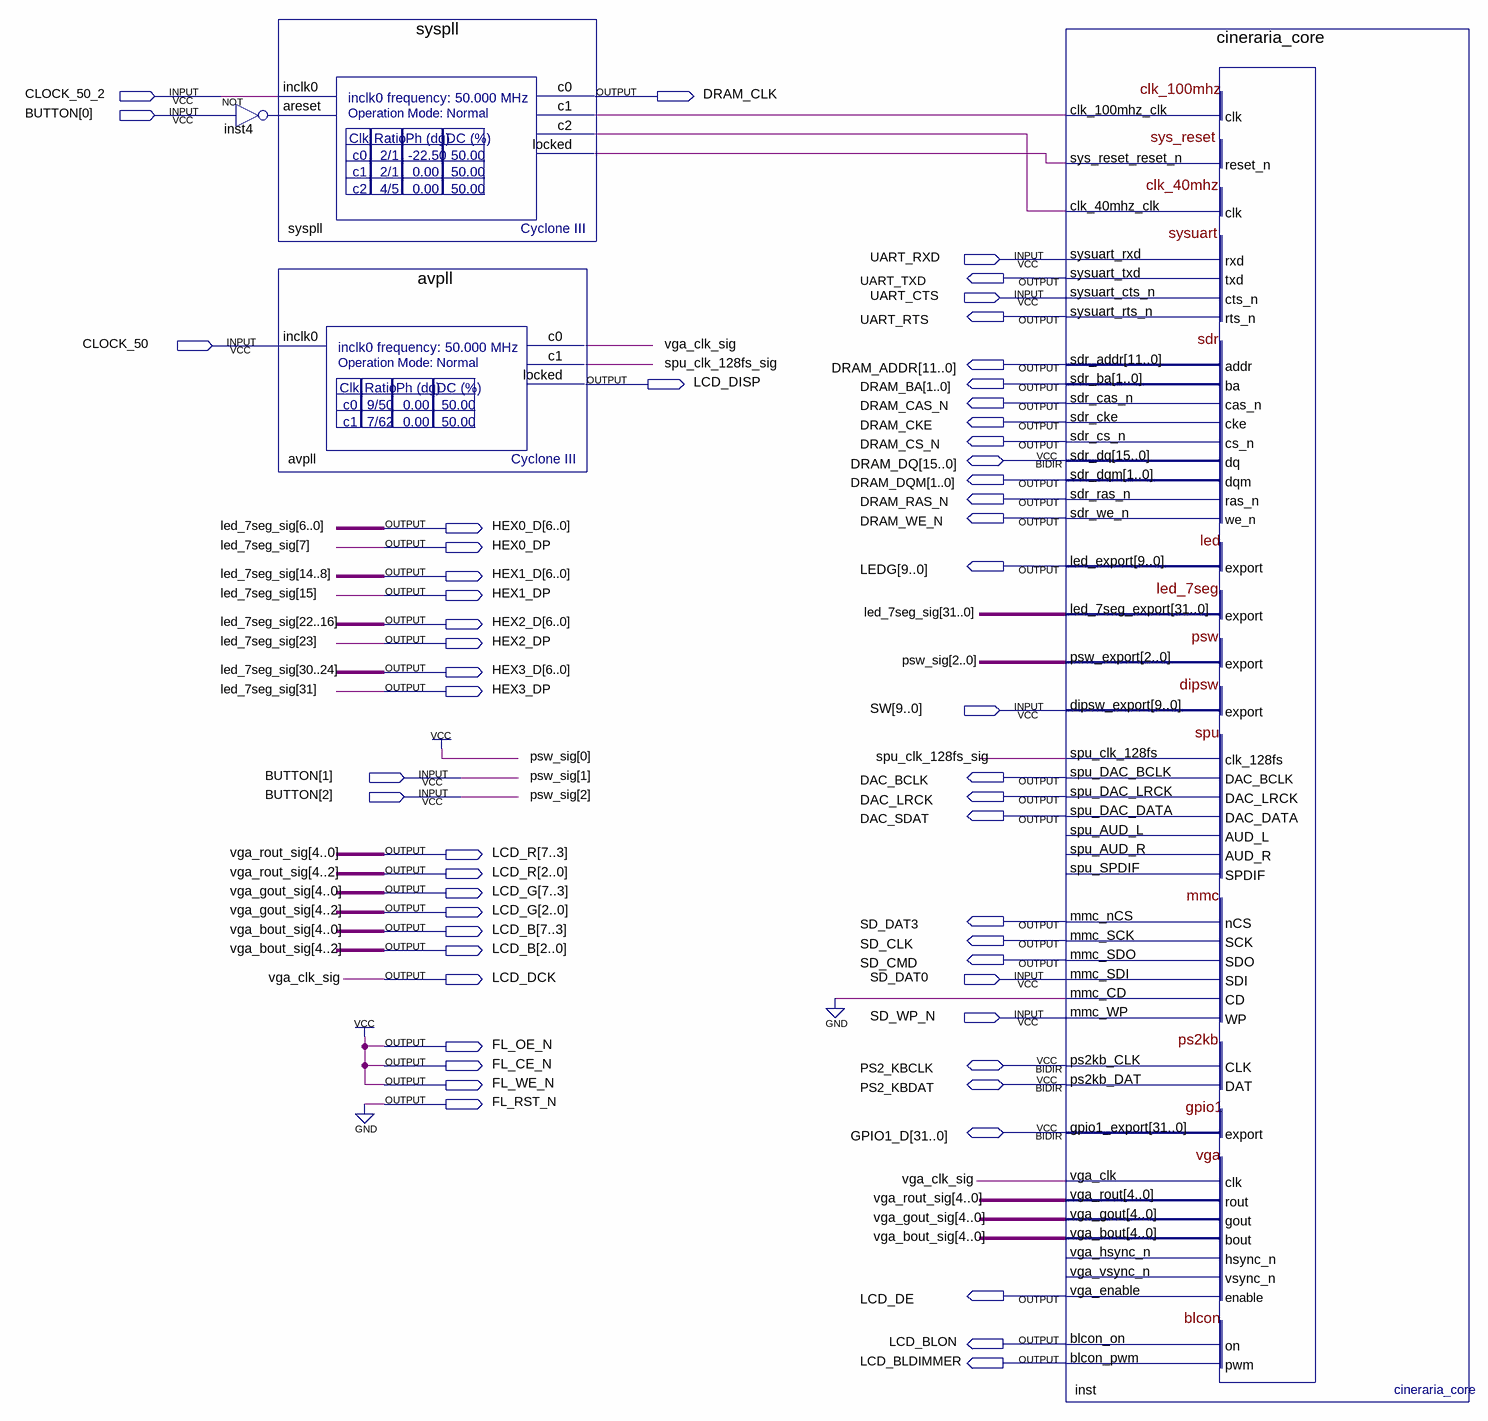
[diagram p0: schematic sheet]
// Quartus schematic cineraria_ulexite_top.bdf as structural Verilog: 4 symbols, 55 pins
module cineraria_ulexite_top (
  input  CLOCK_50_2,
  input  [2:0] BUTTON,
  input  UART_RXD,
  input  UART_CTS,
  input  CLOCK_50,
  input  [9:0] SW,
  input  SD_DAT0,
  input  SD_WP_N,
  inout  [15:0] DRAM_DQ,
  inout  PS2_KBCLK,
  inout  PS2_KBDAT,
  inout  [31:0] GPIO1_D,
  output DRAM_CLK,
  output UART_TXD,
  output UART_RTS,
  output [11:0] DRAM_ADDR,
  output LCD_DISP,
  output [1:0] DRAM_BA,
  output DRAM_CAS_N,
  output DRAM_CKE,
  output DRAM_CS_N,
  output [1:0] DRAM_DQM,
  output DRAM_RAS_N,
  output DRAM_WE_N,
  output [6:0] HEX0_D,
  output HEX0_DP,
  output [9:0] LEDG,
  output [6:0] HEX1_D,
  output HEX1_DP,
  output [6:0] HEX2_D,
  output HEX2_DP,
  output [6:0] HEX3_D,
  output HEX3_DP,
  output DAC_BCLK,
  output DAC_LRCK,
  output DAC_SDAT,
  output [7:0] LCD_R,
  output [7:0] LCD_G,
  output SD_DAT3,
  output [7:0] LCD_B,
  output SD_CLK,
  output SD_CMD,
  output LCD_DCK,
  output FL_OE_N,
  output FL_CE_N,
  output FL_WE_N,
  output FL_RST_N,
  output LCD_DE,
  output LCD_BLON,
  output LCD_BLDIMMER
);

  wire inst4_out, spu_clk_128fs_sig, syspll_c1, syspll_c2, syspll_locked;

  not inst4 (inst4_out, BUTTON[0]);
  syspll syspll (
    .inclk0(CLOCK_50_2), .areset(inst4_out), .c0(DRAM_CLK), .c1(syspll_c1), .c2(syspll_c2),
    .locked(syspll_locked));
  avpll avpll (.inclk0(CLOCK_50), .c0(LCD_DCK), .c1(spu_clk_128fs_sig), .locked(LCD_DISP));
  cineraria_core inst (
    .clk_100mhz_clk(syspll_c1), .sys_reset_reset_n(syspll_locked), .clk_40mhz_clk(syspll_c2),
    .sysuart_rxd(UART_RXD), .sysuart_cts_n(UART_CTS), .psw_export({BUTTON[2:1], 1'b1}), .dipsw_export(SW),
    .spu_clk_128fs(spu_clk_128fs_sig), .mmc_SDI(SD_DAT0), .mmc_CD(1'b0), .mmc_WP(SD_WP_N), .vga_clk(LCD_DCK),
    .sysuart_txd(UART_TXD), .sysuart_rts_n(UART_RTS), .sdr_addr(DRAM_ADDR), .sdr_ba(DRAM_BA),
    .sdr_cas_n(DRAM_CAS_N), .sdr_cke(DRAM_CKE), .sdr_cs_n(DRAM_CS_N), .sdr_dqm(DRAM_DQM),
    .sdr_ras_n(DRAM_RAS_N), .sdr_we_n(DRAM_WE_N), .led_export(LEDG),
    .led_7seg_export({HEX3_DP, HEX3_D, HEX2_DP, HEX2_D, HEX1_DP, HEX1_D, HEX0_DP, HEX0_D}),
    .spu_DAC_BCLK(DAC_BCLK), .spu_DAC_LRCK(DAC_LRCK), .spu_DAC_DATA(DAC_SDAT), .mmc_nCS(SD_DAT3),
    .mmc_SCK(SD_CLK), .mmc_SDO(SD_CMD), .vga_rout(LCD_R[7:3]), .vga_gout(LCD_G[7:3]), .vga_bout(LCD_B[7:3]),
    .vga_enable(LCD_DE), .blcon_on(LCD_BLON), .blcon_pwm(LCD_BLDIMMER), .sdr_dq(DRAM_DQ),
    .ps2kb_CLK(PS2_KBCLK), .ps2kb_DAT(PS2_KBDAT), .gpio1_export(GPIO1_D));  // open: spu_AUD_L, spu_AUD_R, spu_SPDIF, vga_hsync_n, vga_vsync_n

  assign FL_CE_N = 1'b1;
  assign FL_OE_N = 1'b1;
  assign FL_RST_N = 1'b0;
  assign FL_WE_N = 1'b1;
  assign LCD_B[2:0] = LCD_B[7:5];
  assign LCD_G[2:0] = LCD_G[7:5];
  assign LCD_R[2:0] = LCD_R[7:5];

  // Other names for the same wires on the sheet: led_7seg_sig[31:0] = {HEX3_DP, HEX3_D, HEX2_DP, HEX2_D, HEX1_DP, HEX1_D, HEX0_DP, HEX0_D};
  //   psw_sig[2:1] = BUTTON[2:1]; vga_bout_sig[4:0] = LCD_B[7:3]; vga_clk_sig = LCD_DCK;
  //   vga_gout_sig[4:0] = LCD_G[7:3]; vga_rout_sig[4:0] = LCD_R[7:3]
endmodule
